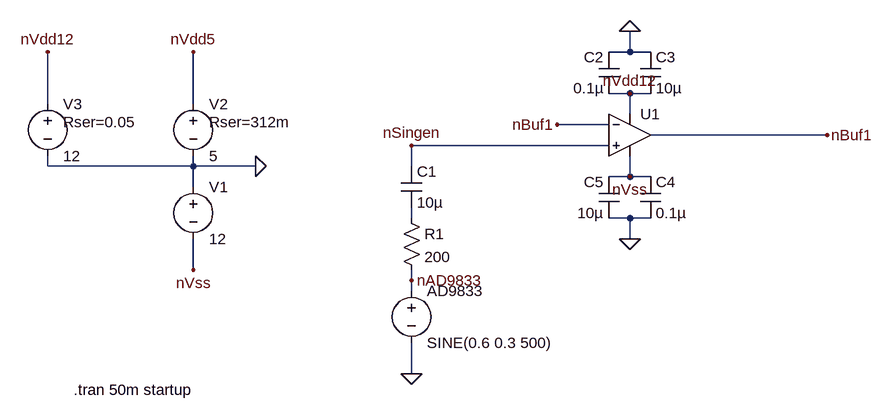
[diagram p0: schematic Stage1Singen_Buffer.asc]
Stage1Singen_Buffer.asc, the LTspice schematic file:
Version 4
SHEET 1 2160 680
WIRE 848 -144 848 -176
WIRE 848 -144 816 -144
WIRE 880 -144 848 -144
WIRE 848 -80 816 -80
WIRE 880 -80 848 -80
WIRE -48 -64 -48 -144
WIRE 176 -64 176 -144
WIRE 848 -48 848 -80
WIRE 816 -32 736 -32
WIRE 1152 -16 880 -16
WIRE 816 0 512 0
WIRE -48 32 -48 16
WIRE 176 32 176 16
WIRE 176 32 -48 32
WIRE 272 32 176 32
WIRE 512 32 512 0
WIRE 848 48 848 16
WIRE 848 48 816 48
WIRE 880 48 848 48
WIRE 176 64 176 32
WIRE 512 112 512 96
WIRE 848 112 816 112
WIRE 880 112 848 112
WIRE 848 144 848 112
WIRE 176 192 176 144
WIRE 512 208 512 192
WIRE 512 224 512 208
WIRE 512 352 512 304
FLAG 272 32 0
FLAG 176 192 nVss
FLAG 176 -144 nVdd5
FLAG -48 -144 nVdd12
FLAG 848 -80 nVdd12
FLAG 848 48 nVss
FLAG 512 0 nSingen
FLAG 736 -32 nBuf1
FLAG 1152 -16 nBuf1
FLAG 848 -176 0
FLAG 848 144 0
FLAG 512 352 0
FLAG 512 208 nAD9833
SYMBOL voltage 176 48 R0
WINDOW 123 0 0 Left 0
WINDOW 39 0 0 Left 0
SYMATTR InstName V1
SYMATTR Value 12
SYMBOL voltage 176 -80 R0
WINDOW 123 0 0 Left 0
WINDOW 39 24 44 Left 2
SYMATTR SpiceLine Rser=312m
SYMATTR InstName V2
SYMATTR Value 5
SYMBOL voltage -48 -80 R0
WINDOW 123 0 0 Left 0
WINDOW 39 24 44 Left 2
SYMATTR SpiceLine Rser=0.05
SYMATTR InstName V3
SYMATTR Value 12
SYMBOL cap 832 -80 R180
WINDOW 0 24 56 Left 2
WINDOW 3 24 8 Left 2
SYMATTR InstName C2
SYMATTR Value 0.1µ
SYMATTR SpiceLine V=16 Irms=0.6 Rser=0.05
SYMBOL cap 864 -144 R0
SYMATTR InstName C3
SYMATTR Value 10µ
SYMATTR SpiceLine V=10 Irms=1.25 Rser=5m
SYMBOL cap 864 48 R0
SYMATTR InstName C4
SYMATTR Value 0.1µ
SYMATTR SpiceLine V=16 Irms=0.6 Rser=0.05
SYMBOL cap 832 112 R180
WINDOW 0 24 56 Left 2
WINDOW 3 24 8 Left 2
SYMATTR InstName C5
SYMATTR Value 10µ
SYMATTR SpiceLine V=10 Irms=1.25 Rser=5m
SYMBOL voltage 512 208 R0
WINDOW 123 0 0 Left 0
WINDOW 39 0 0 Left 0
SYMATTR InstName AD9833
SYMATTR Value SINE(0.6 0.3 500)
SYMBOL res 496 96 R0
SYMATTR InstName R1
SYMATTR Value 200
SYMBOL cap 496 32 R0
SYMATTR InstName C1
SYMATTR Value 10µ
SYMBOL OpAmps\\UniversalOpAmp2 848 -16 R0
SYMATTR InstName U1
TEXT -8 376 Left 2 !.tran 50m startup

The netlist it stands for:
* Stage1Singen_Buffer.asc
V1 0 nVss 12
V2 nVdd5 0 5 Rser=312m
V3 nVdd12 0 12 Rser=0.05
C2 nVdd12 0 0.1µ V=16 Irms=0.6 Rser=0.05
C3 0 nVdd12 10µ V=10 Irms=1.25 Rser=5m
C4 nVss 0 0.1µ V=16 Irms=0.6 Rser=0.05
C5 0 nVss 10µ V=10 Irms=1.25 Rser=5m
V§AD9833 nAD9833 0 SINE(0.6 0.3 500)
R1 N001 nAD9833 200
C1 nSingen N001 10µ
XU1 nSingen nBuf1 nVdd12 nVss nBuf1 level2 Avol=1Meg GBW=10Meg Slew=10Meg Ilimit=25m Rail=0 Vos=0 En=0 Enk=0 In=0 Ink=0 Rin=500Meg  ; pins In+ In- V+ V- OUT
.tran 50m startup
.lib UniversalOpAmp2.lib
.backanno
.end